# Altium schematic sheet NBT_CPU.SchDoc
size B; Organization: Altium Limited; Address1: L3, 12a Rodborough Rd; Address2: Frenchs Forest; Address3: NSW; Address4: Australia 2086; DocumentNumber: 2; SheetNumber: 2; SheetTotal: 2
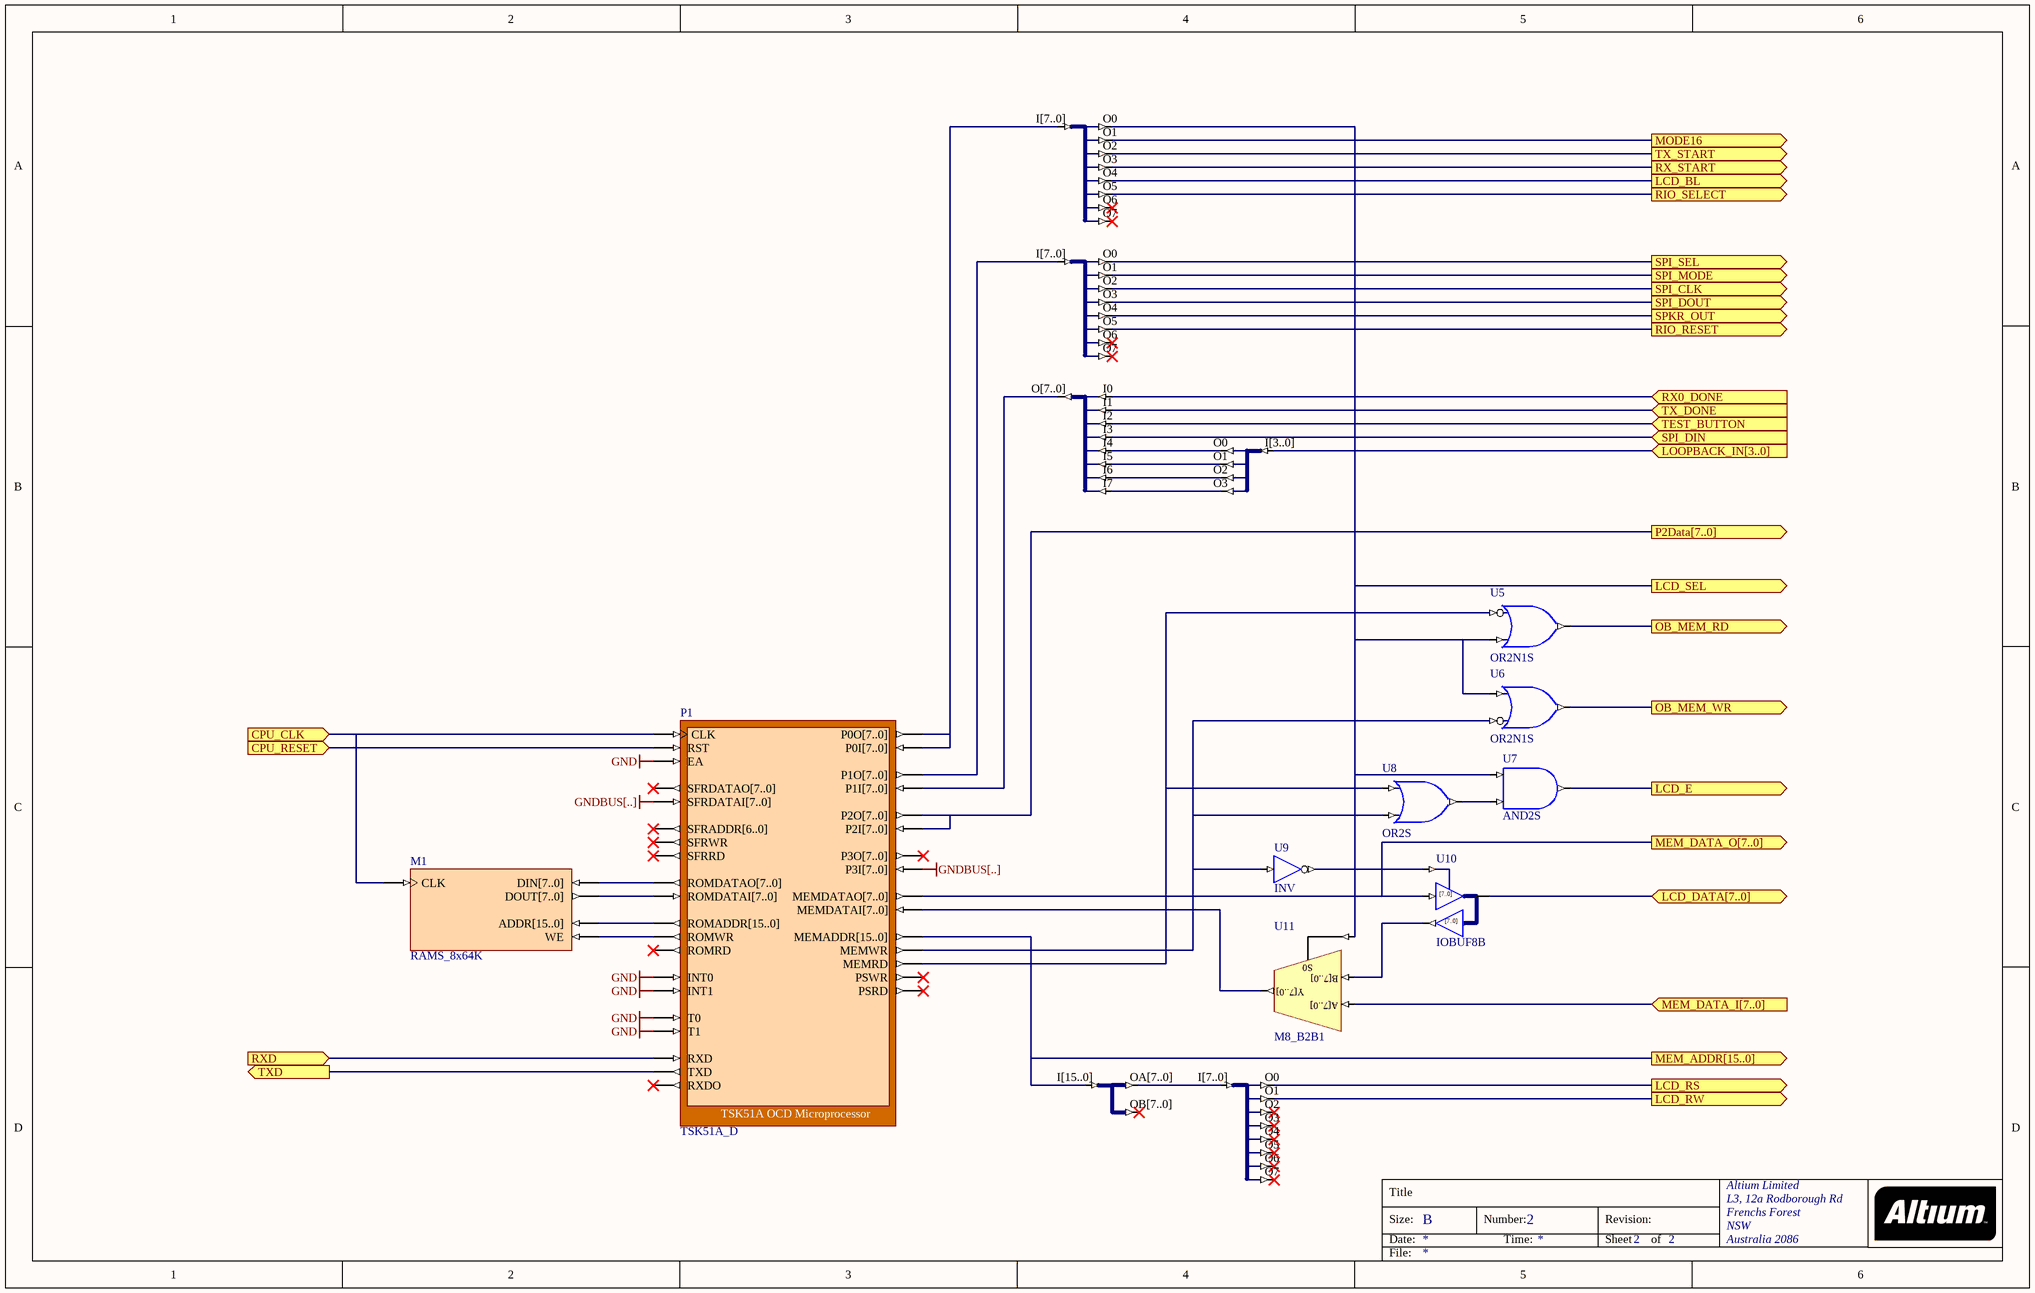
[diagram p0: NBT_CPU.SchDoc]

## Parts
M1  RAMS_8x64K
P1  TSK51A_D
U1  J8B_8S  (value not drawn)
U2  J8B_8S  (value not drawn)
U3  J4B_4S  (value not drawn)
U4  J8S_8B  (value not drawn)
U5  OR2N1S
U6  OR2N1S
U7  AND2S
U8  OR2S
U9  INV
U10  IOBUF8B
U11  M8_B2B1
U12  J16B_8B2  (value not drawn)
U13  J8B_8S  (value not drawn)

## Ports
CPU_CLK (in), CPU_RESET (in), LCD_BL (out), LCD_DATA[7..0] (bidir), LCD_E (out), LCD_RS (out), LCD_RW (out), LCD_SEL (out), LOOPBACK_IN[3..0] (in), MEM_ADDR[15..0] (out), MEM_DATA_I[7..0] (in), MEM_DATA_O[7..0] (out), MODE16 (out), OB_MEM_RD (out), OB_MEM_WR (out), P2Data[7..0] (out), RIO_RESET (out), RIO_SELECT (out), RX0_DONE (in), RX_START (out), RXD (in), SPI_CLK (out), SPI_DIN (in), SPI_DOUT (out), SPI_MODE (out), SPI_SEL (out), SPKR_OUT (out), TEST_BUTTON (in), TX_DONE (in), TX_START (out), TXD (out)

## Nets
GND: P1.EA P1.INT0 P1.INT1 P1.T0 P1.T1
GNDBUS[..]: P1.P3I[7..0] P1.SFRDATAI[7..0]
CPU_CLK: M1.CLK P1.CLK ; port CPU_CLK
CPU_RESET: P1.RST ; port CPU_RESET
LCD_BL: U1.O4 ; port LCD_BL
LCD_DATA[7..0]: U10.IO[7..0] ; port LCD_DATA[7..0]
LCD_E: U7.O ; port LCD_E
LCD_RS: U13.O0 ; port LCD_RS
LCD_RW: U13.O1 ; port LCD_RW
LCD_SEL: U1.O0 U5.I1 U6.I1 U7.I0 U11.S0 ; port LCD_SEL
LOOPBACK_IN[3..0]: U3.I[3..0] ; port LOOPBACK_IN[3..0]
MEM_ADDR[15..0]: P1.MEMADDR[15..0] U12.I[15..0] ; port MEM_ADDR[15..0]
MEM_DATA_I[7..0]: U11.A[7..0] ; port MEM_DATA_I[7..0]
MEM_DATA_O[7..0]: P1.MEMDATAO[7..0] U10.I[7..0] ; port MEM_DATA_O[7..0]
MODE16: U1.O1 ; port MODE16
OB_MEM_RD: U5.O ; port OB_MEM_RD
OB_MEM_WR: U6.O ; port OB_MEM_WR
P2Data[7..0]: P1.P2I[7..0] P1.P2O[7..0] ; port P2Data[7..0]
RIO_RESET: U2.O5 ; port RIO_RESET
RIO_SELECT: U1.O5 ; port RIO_SELECT
RX0_DONE: U4.I0 ; port RX0_DONE
RX_START: U1.O3 ; port RX_START
RXD: P1.RXD ; port RXD
SPI_CLK: U2.O2 ; port SPI_CLK
SPI_DIN: U4.I3 ; port SPI_DIN
SPI_DOUT: U2.O3 ; port SPI_DOUT
SPI_MODE: U2.O1 ; port SPI_MODE
SPI_SEL: U2.O0 ; port SPI_SEL
SPKR_OUT: U2.O4 ; port SPKR_OUT
TEST_BUTTON: U4.I2 ; port TEST_BUTTON
TX_DONE: U4.I1 ; port TX_DONE
TX_START: U1.O2 ; port TX_START
TXD: P1.TXD ; port TXD
NetM1_ADDR[15..0]: M1.ADDR[15..0] P1.ROMADDR[15..0]
NetM1_DIN[7..0]: M1.DIN[7..0] P1.ROMDATAO[7..0]
NetM1_DOUT[7..0]: M1.DOUT[7..0] P1.ROMDATAI[7..0]
NetM1_WE: M1.WE P1.ROMWR
NetP1_MEMDATAI[7..0]: P1.MEMDATAI[7..0] U11.Y[7..0]
NetP1_MEMRD: P1.MEMRD U5.I0 U8.I0
NetP1_MEMWR: P1.MEMWR U6.I0 U8.I1 U9.I
NetP1_P0I[7..0]: P1.P0I[7..0] P1.P0O[7..0] U1.I[7..0]
NetP1_P1I[7..0]: P1.P1I[7..0] U4.O[7..0]
NetP1_P1O[7..0]: P1.P1O[7..0] U2.I[7..0]
NetU3_O0: U3.O0 U4.I4
NetU3_O1: U3.O1 U4.I5
NetU3_O2: U3.O2 U4.I6
NetU3_O3: U3.O3 U4.I7
NetU7_I1: U7.I1 U8.O
NetU9_O: U9.O U10.T
NetU10_O[7..0]: U10.O[7..0] U11.B[7..0]
NetU12_OA[7..0]: U12.OA[7..0] U13.I[7..0]

Not connected (* = marked no-connect by the designer): P1 P3O[7..0]* PSRD* PSWR* ROMRD* RXDO* SFRADDR[6..0]* SFRDATAO[7..0]* SFRRD* SFRWR*; U1 O6* O7*; U2 O6* O7*; U12 OB[7..0]*; U13 O2* O3* O4* O5* O6* O7*

## Notes on the sheet
- Title
- Size:
- Date:
- B
- Number:
- Time:
- Revision:
- Sheet
- of
- File:
- (in symbol IOBUF8B) [7..0]

## Library data of the parts
M1 = RAMS_8x64K: Single Port RAM; Memory_Depth: 65536; Memory_Type: RAM_SinglePortBlock; Memory_Width: 8; Memory_ClockEdge: Rising; Nexus_Core: Memory_Program; Memory_EnablePin: False; Published: 23/04/2004; Publisher: Altium Hobart Technology Center
P1 = TSK51A_D: TSK51A OCD Microprocessor; NEXUS_CORE: Processor_OCDS; NEXUS_JTAG_DEVICE: True; NEXUS_JTAG_ORDER: 0; ChildModel1: RAM256x8_TSK51D; Memory_Configuration: Record[NEXUS_CORE]{}ComponentDesignator[iram]{}Memory_Depth[256]{}Memory_UsageType[ram]{}ProgramDownloadAddress[0x0]{}Memory_BusType[c51:idata_bus]{n}{}Record[NEXUS_CORE]{}ComponentDesignator[xram]{}Memory_Depth[1]{}Memory_UsageType[ram]{}ProgramDownloadAddress[0x0]{}Memory_BusType[c51:xdata_bus]{n}{}Record[NEXUS_CORE]{}ComponentDesignator[xrom]{}Memory_Depth[64k]{}Memory_UsageType[rom]{}ProgramDownloadAddress[0x0]{}Memory_BusType[c51:code_bus]{n}; Published: 18/12/2003; Publisher: Altium Hobart Technology Centre; Core Revision: 1.00.00
U1 U2 U13 = J8B_8S: 8-Bit input bus to 8 single pin outputs; FunctionalClass: Bus Joiner; PortSize: 8; ArchiveName: GENERIC; VHDLIB_SIM: GENERIC_LIB; Published: 29-Jan-2004; Publisher: Altium Limited; LastRevisionNo: 1.00.00; HelpURL: CR0118 FPGA Generic Library Guide.pdf#page=303; ComponentLink1URL: CR0126 FPGA Bus Joiner Resource Usage.pdf#page=27; ComponentLink1Description: Core &Resource Usage
U3 = J4B_4S: 4-Bit input bus to 4 Single pin outputs; ArchiveName: GENERIC; VHDLIB_SIM: GENERIC_LIB; Published: 29-Jan-2004; Publisher: Altium Limited; Core Revision: 1.00.00
U4 = J8S_8B: 8 Single pin inputs to single 8-Bit output bus; FunctionalClass: Bus Joiner; PortSize: 8; ArchiveName: GENERIC; VHDLIB_SIM: GENERIC_LIB; Published: 29-Jan-2004; Publisher: Altium Limited; LastRevisionNo: 1.00.00; HelpURL: CR0118 FPGA Generic Library Guide.pdf#page=305; ComponentLink1URL: CR0126 FPGA Bus Joiner Resource Usage.pdf#page=28; ComponentLink1Description: Core &Resource Usage
U5 U6 = OR2N1S: 2-Input OR Gate with Active Low A Input, Single Pin Version; Xilinx Equivalent: OR2B1; ArchiveName: GENERIC; VHDLIB_SIM: GENERIC_LIB; Published: 29-Jan-2004; Publisher: Altium Limited; Core Revision: 1.00.00
U7 = AND2S: 2-Input AND Gate, Single Pin Version; Xilinx Equivalent: AND2; ArchiveName: GENERIC; VHDLIB_SIM: GENERIC_LIB; Published: 29-Jan-2004; Publisher: Altium Limited; Core Revision: 1.00.00
U8 = OR2S: 2-Input OR Gate, Single Pin Version; Xilinx Equivalent: OR2; ArchiveName: GENERIC; VHDLIB_SIM: GENERIC_LIB; Published: 29-Jan-2004; Publisher: Altium Limited; Core Revision: 1.00.00
U9 = INV: Inverter; ArchiveName: GENERIC; VHDLIB_SIM: GENERIC_LIB; Published: 29-Jan-2004; Publisher: Altium Limited; Xilinx Equivalent: INV; Core Revision: 1.00.00
U10 = IOBUF8B: 8-Bit Input/Output Buffer, Bus Version; ArchiveName: GENERIC; VHDLIB_SIM: GENERIC_LIB; Published: 29-Jan-2004; Publisher: Altium Limited; Core Revision: 1.00.00
U11 = M8_B2B1: 2x8-Bit Bus to 1x8-Bit Bus Multiplexer; ArchiveName: GENERIC; VHDLIB_SIM: GENERIC_LIB; Published: 29-Jan-2004; Publisher: Altium Limited; Core Revision: 1.00.00
U12 = J16B_8B2: 1 x 16-bit input bus to 2 x 8-Bit output bus; FunctionalClass: Bus Joiner; PortSize: 16; ArchiveName: GENERIC; VHDLIB_SIM: GENERIC_LIB; Published: 29-Jan-2004; Publisher: Altium Limited; LastRevisionNo: 1.00.00; HelpURL: CR0118 FPGA Generic Library Guide.pdf#page=297; ComponentLink1URL: CR0126 FPGA Bus Joiner Resource Usage.pdf#page=42; ComponentLink1Description: Core &Resource Usage